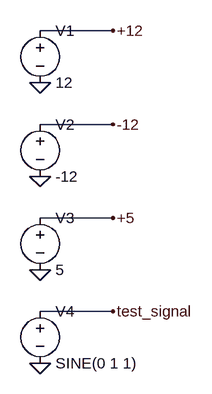
[diagram p0: schematic _template.asc]
_template.asc, the LTspice schematic file:
Version 4
SHEET 1 880 680
WIRE 160 -96 48 -96
WIRE 160 48 48 48
WIRE 160 192 48 192
WIRE 160 336 48 336
FLAG 48 -16 0
FLAG 48 128 0
FLAG 48 272 0
FLAG 48 416 0
FLAG 160 -96 +12
FLAG 160 48 -12
FLAG 160 192 +5
FLAG 160 336 test_signal
SYMBOL voltage 48 -112 R0
WINDOW 123 0 0 Left 0
WINDOW 39 0 0 Left 0
SYMATTR InstName V1
SYMATTR Value 12
SYMBOL voltage 48 32 R0
WINDOW 123 0 0 Left 0
WINDOW 39 0 0 Left 0
SYMATTR InstName V2
SYMATTR Value -12
SYMBOL voltage 48 176 R0
WINDOW 123 0 0 Left 0
WINDOW 39 0 0 Left 0
SYMATTR InstName V3
SYMATTR Value 5
SYMBOL voltage 48 320 R0
WINDOW 123 0 0 Left 0
WINDOW 39 0 0 Left 0
SYMATTR InstName V4
SYMATTR Value SINE(0 1 1)

The netlist it stands for:
* _template.asc
V1 +12 0 12
V2 -12 0 -12
V3 +5 0 5
V4 test_signal 0 SINE(0 1 1)
.backanno
.end